# Altium project KSP_PCB.PrjPcb
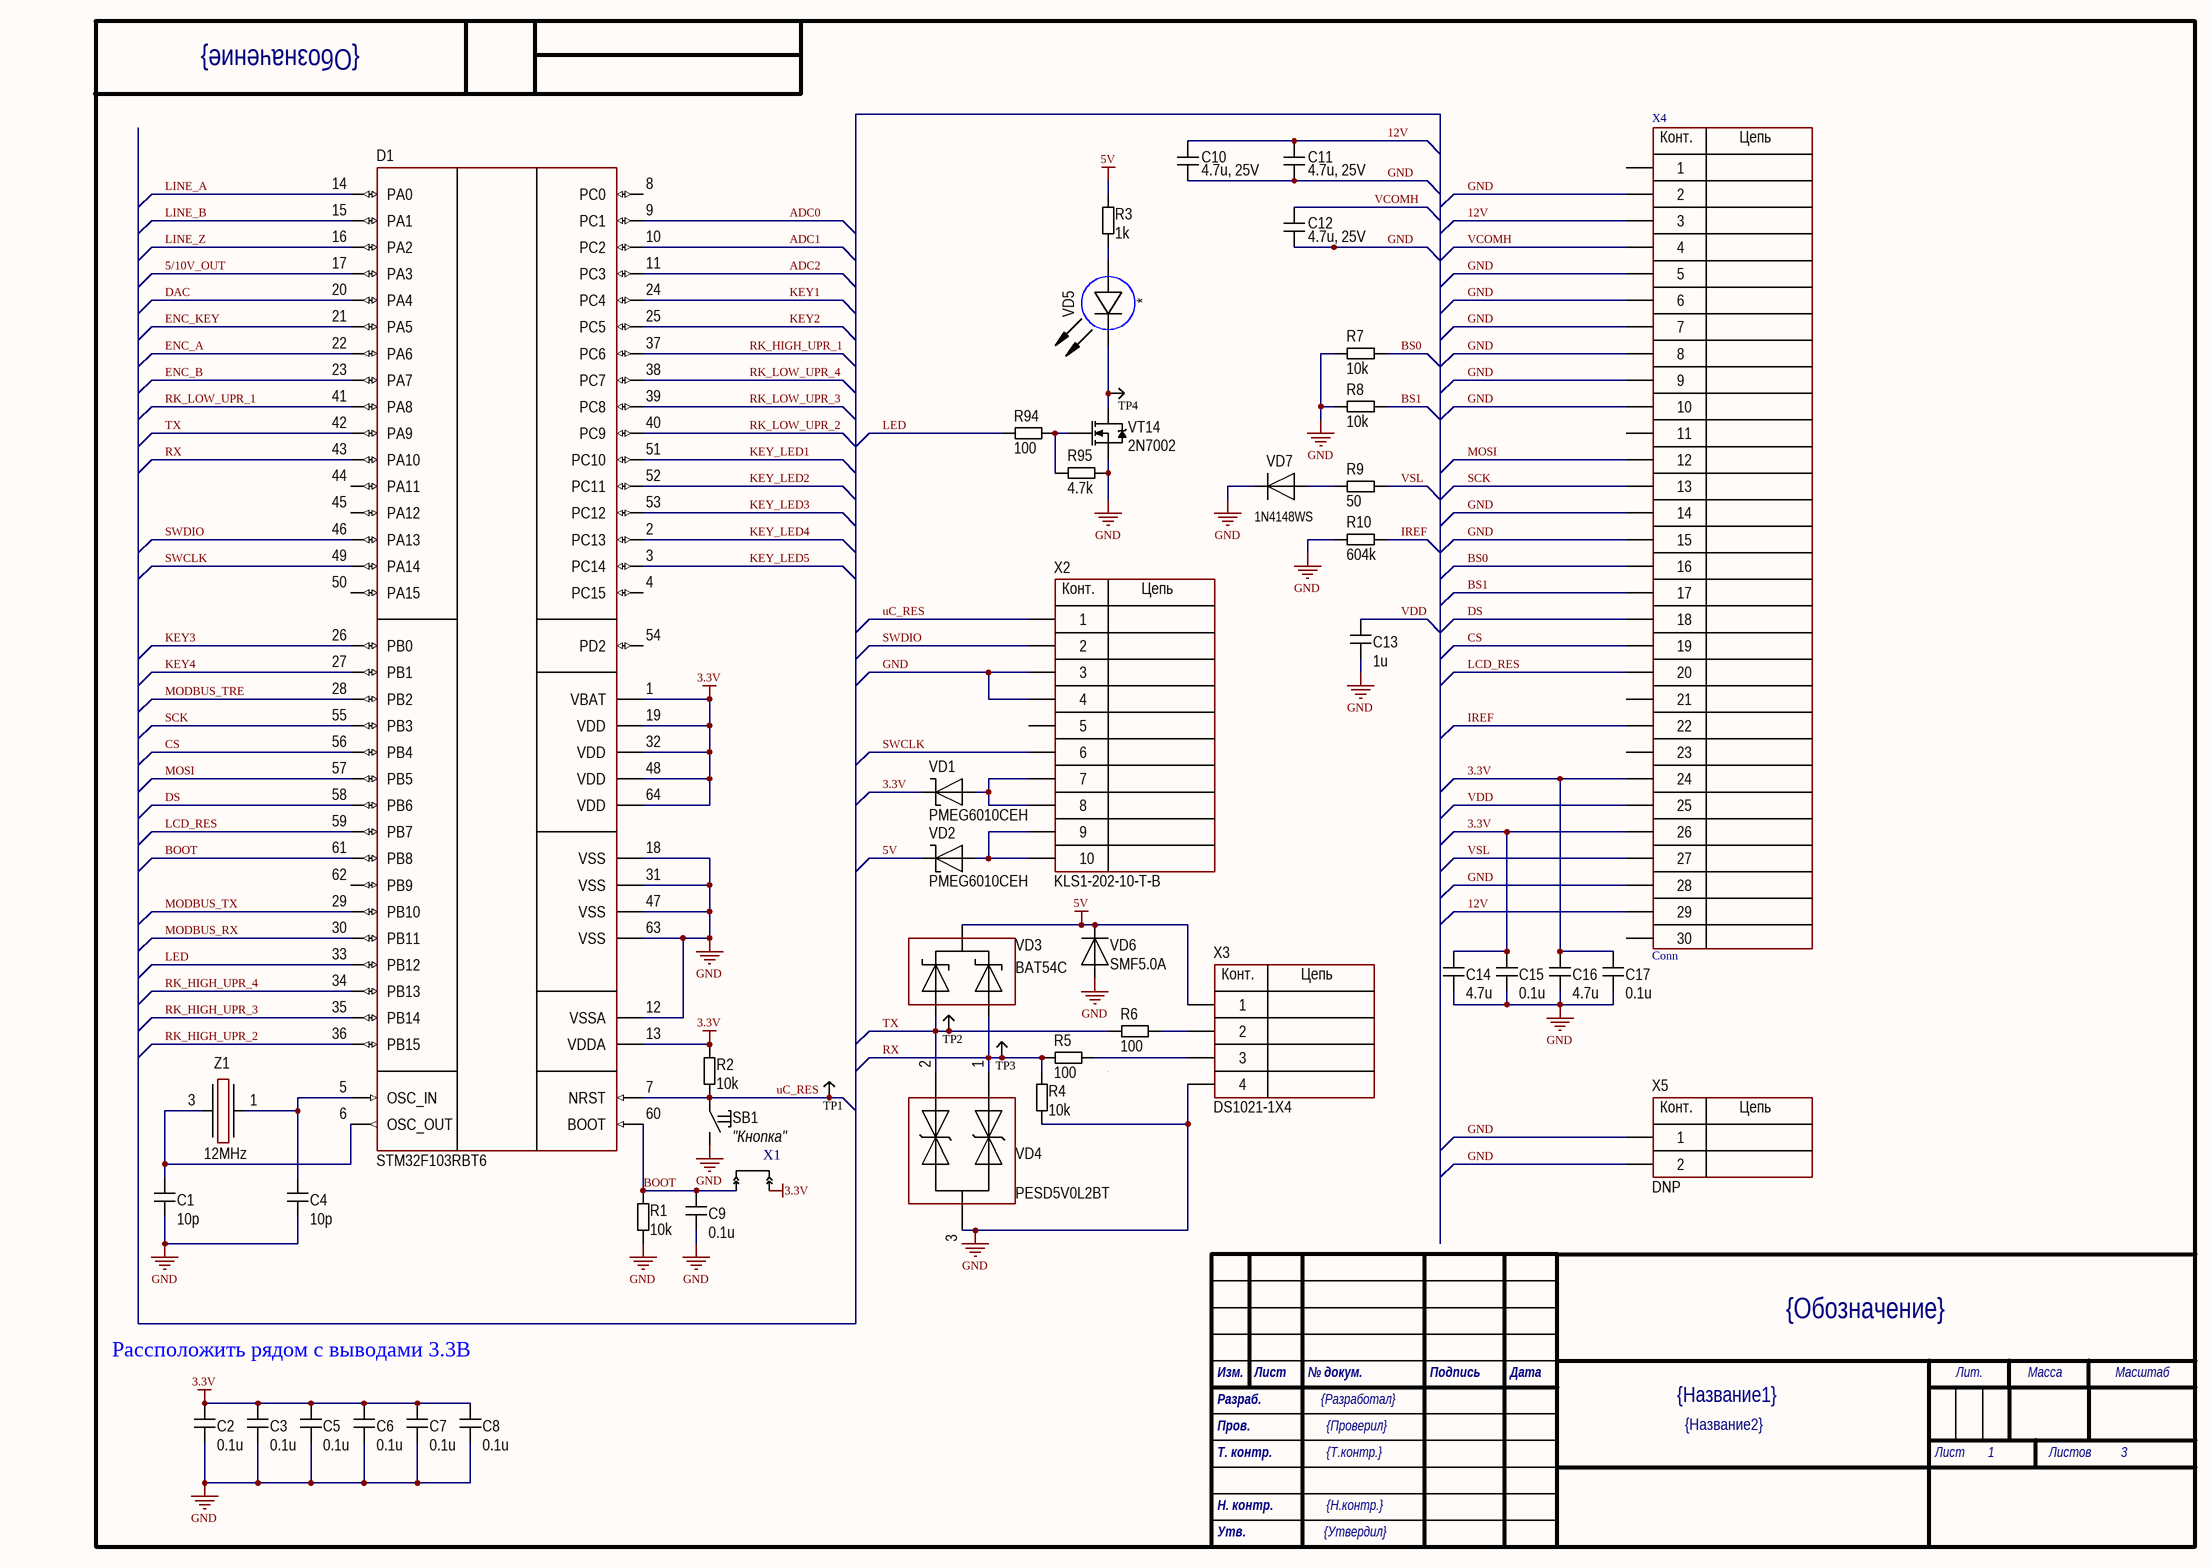
[diagram p0: 1_uC.SchDoc]
3 sheets, 210 parts. Net scope: global (net labels, ports and power ports of the same name join across sheets).
Board file: KSP_PCB.PcbDoc
Sheets:
  1_uC.SchDoc
  2_Connection.SchDoc
  3_RK.SchDoc

## Sheet 1_uC.SchDoc
size 414 x 293 mm; SheetNumber: 1; SheetTotal: 3; PageSetup: Record=PageOptionsZCenterHorizontal=TrueZCenterVertical=TrueZPrintScale=1.00ZXCorrection=0.00ZYCorrection=0.00ZPrintKind=1ZBorderSize=5000000ZLeftOffset=0ZBottomOffset=0ZOrientation=2ZPaperLength=1000ZPaperWidth=1000ZScale=100ZPaperSource=7ZPrintQuality=-4ZMediaType=1ZDitherType=10ZPaperKind=A3ZPrintScaleMode=0; Razrabotal: {Разработал}; Proveril: {Проверил}; Tkontr: {Т.контр.}; Nkontr: {Н.контр.}; Ytverdil: {Утвердил}; Nazvanie1: {Название1}; Nazvanie2: {Название2}; Oboznachenie: {Обозначение}

### Parts
C1  10p  [CH0402C]
C2  0.1u  [CH0603C]
C3  0.1u  [CH0603C]
C4  10p  [CH0402C]
C5  0.1u  [CH0603C]
C6  0.1u  [CH0603C]
C7  0.1u  [CH0603C]
C8  0.1u  [CH0603C]
C9  0.1u  [CH0603C]
C10  4.7u, 25V  [CH0805C]
C11  4.7u, 25V  [CH0805C]
C12  4.7u, 25V  [CH0805C]
C13  1u  [CH0603C]
C14  4.7u  [CH0603C]
C15  0.1u  [CH0603C]
C16  4.7u  [CH0603C]
C17  0.1u  [CH0603C]
D1  STM32F103RBT6  [64-LQFP]
R1  10k  [CH0603R]
R2  10k  [CH0603R]
R3  1k  [CH0805R]
R4  10k  [CH0603R]
R5  100  [CH0603R]
R6  100  [CH0603R]
R7  10k  [CH0603R]
R8  10k  [CH0603R]
R9  50  [CH0603R]
R10  604k  [CH0603R]
R94  100  [CH0603R]
R95  4.7k  [CH0603R]
SB1  "Кнопка"  [TL1014BF160QG]
TP1  (no value)  [TestPoint]
TP2  (no value)  [TestPoint]
TP3  (no value)  [TestPoint]
TP4  (no value)  [TestPoint]
VD1  PMEG6010CEH  [SOD123F]
VD2  PMEG6010CEH  [SOD123F]
VD3  BAT54C  [SOT23_123]
VD4  PESD5V0L2BT  [SOT23_132]
VD5  *  [CH0603LB]
VD6  SMF5.0A  [SOD123F]
VD7  1N4148WS  [SOD323]
VT14  2N7002  [SOT23_123]
X1  JMP-2  [PLS-2]  (value not drawn)
X2  KLS1-202-10-T-B  [CON: IDC-10MS]
X3  DS1021-1X4  [CON: PLS-4]
X4  Conn  [FPC-30]
X5  DNP  [CON: PLS-2]
Z1  12MHz  [OSC: 2520]

### Nets
3.3V: C2.2 C3.2 C5.2 C6.2 C7.2 C8.2 C14.2 C15.2 C16.2 C17.2 D1.1(VBAT) D1.13(VDDA) D1.19(VDD) D1.32(VDD) D1.48(VDD) D1.64(VDD) R2.2 VD1.2 X1.2 X4.24 X4.26
5V: R3.2 VD2.2 VD3.2 VD6.2 X3.1
12V: C10.2 C11.2 X4.3 X4.29
GND: C1.1 C2.1 C3.1 C4.1 C5.1 C6.1 C7.1 C8.1 C9.1 C10.1 C11.1 C12.1 C13.1 C14.1 C15.1 C16.1 C17.1 D1.12(VSSA) D1.18(VSS) D1.31(VSS) D1.47(VSS) D1.63(VSS) R1.1 R4.2 R7.1 R8.1 R10.1 R95.1 SB1.2 VD4.3 VD6.1 VD7.2 VT14.3(S) X2.3 X2.4 X3.4 X4.2 X4.5 X4.6 X4.7 X4.8 X4.9 X4.10 X4.14 X4.15 X4.28 X5.1 X5.2
5/10V_OUT: D1.17(PA3)
ADC0: D1.9(PC1)
ADC1: D1.10(PC2)
ADC2: D1.11(PC3)
BOOT: C9.2 D1.60(BOOT) D1.61(PB8) R1.2 X1.1
BS0: R7.2 X4.16
BS1: R8.2 X4.17
CS: D1.56(PB4) X4.19
DAC: D1.20(PA4)
DS: D1.58(PB6) X4.18
ENC_A: D1.22(PA6)
ENC_B: D1.23(PA7)
ENC_KEY: D1.21(PA5)
IREF: R10.2 X4.22
KEY1: D1.24(PC4)
KEY2: D1.25(PC5)
KEY3: D1.26(PB0)
KEY4: D1.27(PB1)
KEY_LED1: D1.51(PC10)
KEY_LED2: D1.52(PC11)
KEY_LED3: D1.53(PC12)
KEY_LED4: D1.2(PC13)
KEY_LED5: D1.3(PC14)
LCD_RES: D1.59(PB7) X4.20
LED: D1.33(PB12) R94.2
LINE_A: D1.14(PA0)
LINE_B: D1.15(PA1)
LINE_Z: D1.16(PA2)
MODBUS_RX: D1.30(PB11)
MODBUS_TRE: D1.28(PB2)
MODBUS_TX: D1.29(PB10)
MOSI: D1.57(PB5) X4.12
RK_HIGH_UPR_1: D1.37(PC6)
RK_HIGH_UPR_2: D1.36(PB15)
RK_HIGH_UPR_3: D1.35(PB14)
RK_HIGH_UPR_4: D1.34(PB13)
RK_LOW_UPR_1: D1.41(PA8)
RK_LOW_UPR_2: D1.40(PC9)
RK_LOW_UPR_3: D1.39(PC8)
RK_LOW_UPR_4: D1.38(PC7)
RX: D1.43(PA10) R4.1 R5.2 TP3.0 VD3.1 VD4.1
SCK: D1.55(PB3) X4.13
SWCLK: D1.49(PA14) X2.6
SWDIO: D1.46(PA13) X2.2
TX: D1.42(PA9) R6.2 TP2.0 VD3.3 VD4.2
uC_RES: D1.7(NRST) R2.1 SB1.1 TP1.0 X2.1
VCOMH: C12.2 X4.4
VDD: C13.2 X4.25
VSL: R9.2 X4.27
NetC1_2: C1.2 D1.6(OSC_OUT) Z1.3
NetC4_2: C4.2 D1.5(OSC_IN) Z1.1
NetR3_1: R3.1 VD5.1(A)
NetR5_1: R5.1 X3.3
NetR6_1: R6.1 X3.2
NetR9_1: R9.1 VD7.1
NetR94_1: R94.1 R95.2 VT14.1(G)
NetTP4_0: TP4.0 VD5.2(C) VT14.2(D)
NetVD1_1: VD1.1 X2.7 X2.8
NetVD2_1: VD2.1 X2.9 X2.10

Not connected (* = marked no-connect by the designer): D1 4(PC15) 8(PC0) 44(PA11) 45(PA12) 50(PA15) 54(PD2) 62(PB9); X2 5; X4 1 11 21 23 30

### Notes on the sheet
- Рассположить рядом с выводами 3.3В
- Изм.
- Лист
- № докум.
- Подпись
- Дата
- Лит.
- Масса
- Масштаб
- Пров.
- Разраб.
- Т. контр.
- Н. контр.
- Листов
- Утв.
- (in symbol 2-Connector) Конт.; Цепь
- (in symbol 4-Connector) Конт.; Цепь
- (in symbol 10-Connector) Конт.; Цепь
- (in symbol 30-Connector) Конт.; Цепь

### Library data of the parts
C1 C4 = Capacitor: Model: AC0402JRNPO9BN100; Manufacturer: *; HelpURL: *; ComponentKind: *; Value: 10p
C2 C3 C5-C9 C15 C17 = Capacitor: Model: 06035C104JAT2A; Manufacturer: *; HelpURL: *; ComponentKind: *; Value: 0.1u
C10-C12 = Capacitor: Model: 08053C475KAT2A; Manufacturer: *; HelpURL: *; ComponentKind: *; Value: 4.7u, 25V
C13 = Capacitor: Model: 0603B105K250NT; Manufacturer: *; HelpURL: *; ComponentKind: *; Value: 1u
C14 C16 = Capacitor: Model: 06036D475KAT2A; Manufacturer: *; HelpURL: *; ComponentKind: *; Value: 4.7u
D1 = STM32F103RBT6: Cortex-M3; Manufacturer: STMicroelectronics; Model: STM32F103RBT6; HelpURL: https://www.digikey.com/product-detail/en/stmicroelectronics/STM32F103RBT6/497-6066-ND/1646341; ComponentKind: 64-LQFP
R1 R2 R4 R7 R8 = Resistor: Model: CR0603-FX-1002ELF; Manufacturer: *; HelpURL: *; ComponentKind: *; Value: 10k
R3 = Resistor: Model: CR0805-FX-1001ELF; Manufacturer: *; HelpURL: *; ComponentKind: *; Value: *
R5 R6 R94 = Resistor: Model: CR0603-JW-101ELF; Manufacturer: *; HelpURL: *; ComponentKind: *; Value: 100
R9 = Resistor: Model: CR0603-FX-49R9ELF; Manufacturer: *; HelpURL: *; ComponentKind: *; Value: 50
R10 = Resistor: Model: CR0603-FX-6043ELF; Manufacturer: *; HelpURL: *; ComponentKind: *; Value: 604k
R95 = Resistor: Model: CR0603-FX-4701ELF; Manufacturer: *; HelpURL: *; ComponentKind: *; Value: 4.7k
SB1 = Tactile switches: 6x6 mm; Manufacturer: *; Model: TL1014BF160QG; HelpURL: *; ComponentKind: *
TP1-TP4 = TestPoint
VD1 VD2 = Diod Schottky: ComponentKind: *; Manufacturer: *; Model: PMEG6010CEH; HelpURL: *
VD3 = Diod Schottky Array v.1: ComponentKind: *; Manufacturer: *; Model: BAT54C; HelpURL: *
VD4 = TVS Array: ComponentKind: *; Manufacturer: *; Model: PESD5V0L2BT; HelpURL: *
VD5 = LED_1: Model: KPT-1608SGC; Manufacturer: *; HelpURL: *; ComponentKind: *; Value: *
VD6 = Diod: Part Num: SMAF5.0A; ComponentKind: *; Manufacturer: *; Model: SMF5.0A; HelpURL: *
VD7 = Diod: ComponentKind: *; Manufacturer: *; Model: 1N4148WS; HelpURL: *
VT14 = N-chanel: Mosfet; Model: 2N7002; Manufacturer: *; ComponentKind: *; HelpURL: *
X1 = JMP-2: Model: DNP
X2 = 10-Connector: Model: KLS1-202-10-T-B; Manufacturer: *; HelpURL: *; ComponentKind: *
X3 = 4-Connector: Model: DS1021-1X4; Manufacturer: *; HelpURL: *; ComponentKind: *
X4 = 30-Connector: Model: KLS1-242G-2.0-30-T-R
X5 = 2-Connector: Model: DNP; Manufacturer: *; HelpURL: *; ComponentKind: *
Z1 = Oscillator: Model: ECS-120-10-36B2-JTN-TR; Manufacturer: *; HelpURL: *; ComponentKind: *; Value: 12MHz

## Sheet 2_Connection.SchDoc
size 414 x 293 mm; SheetNumber: 2; SheetTotal: 3; PageSetup: Record=PageOptionsZCenterHorizontal=TrueZCenterVertical=TrueZPrintScale=1.00ZXCorrection=0.00ZYCorrection=0.00ZPrintKind=1ZBorderSize=5000000ZLeftOffset=0ZBottomOffset=0ZOrientation=2ZPaperLength=1000ZPaperWidth=1000ZScale=100ZPaperSource=7ZPrintQuality=-4ZMediaType=1ZDitherType=10ZPaperKind=A3ZPrintScaleMode=0; Razrabotal: {Разработал}; Proveril: {Проверил}; Tkontr: {Т.контр.}; Nkontr: {Н.контр.}; Ytverdil: {Утвердил}; Nazvanie1: {Название1}; Nazvanie2: {Название2}; Oboznachenie: {Обозначение}
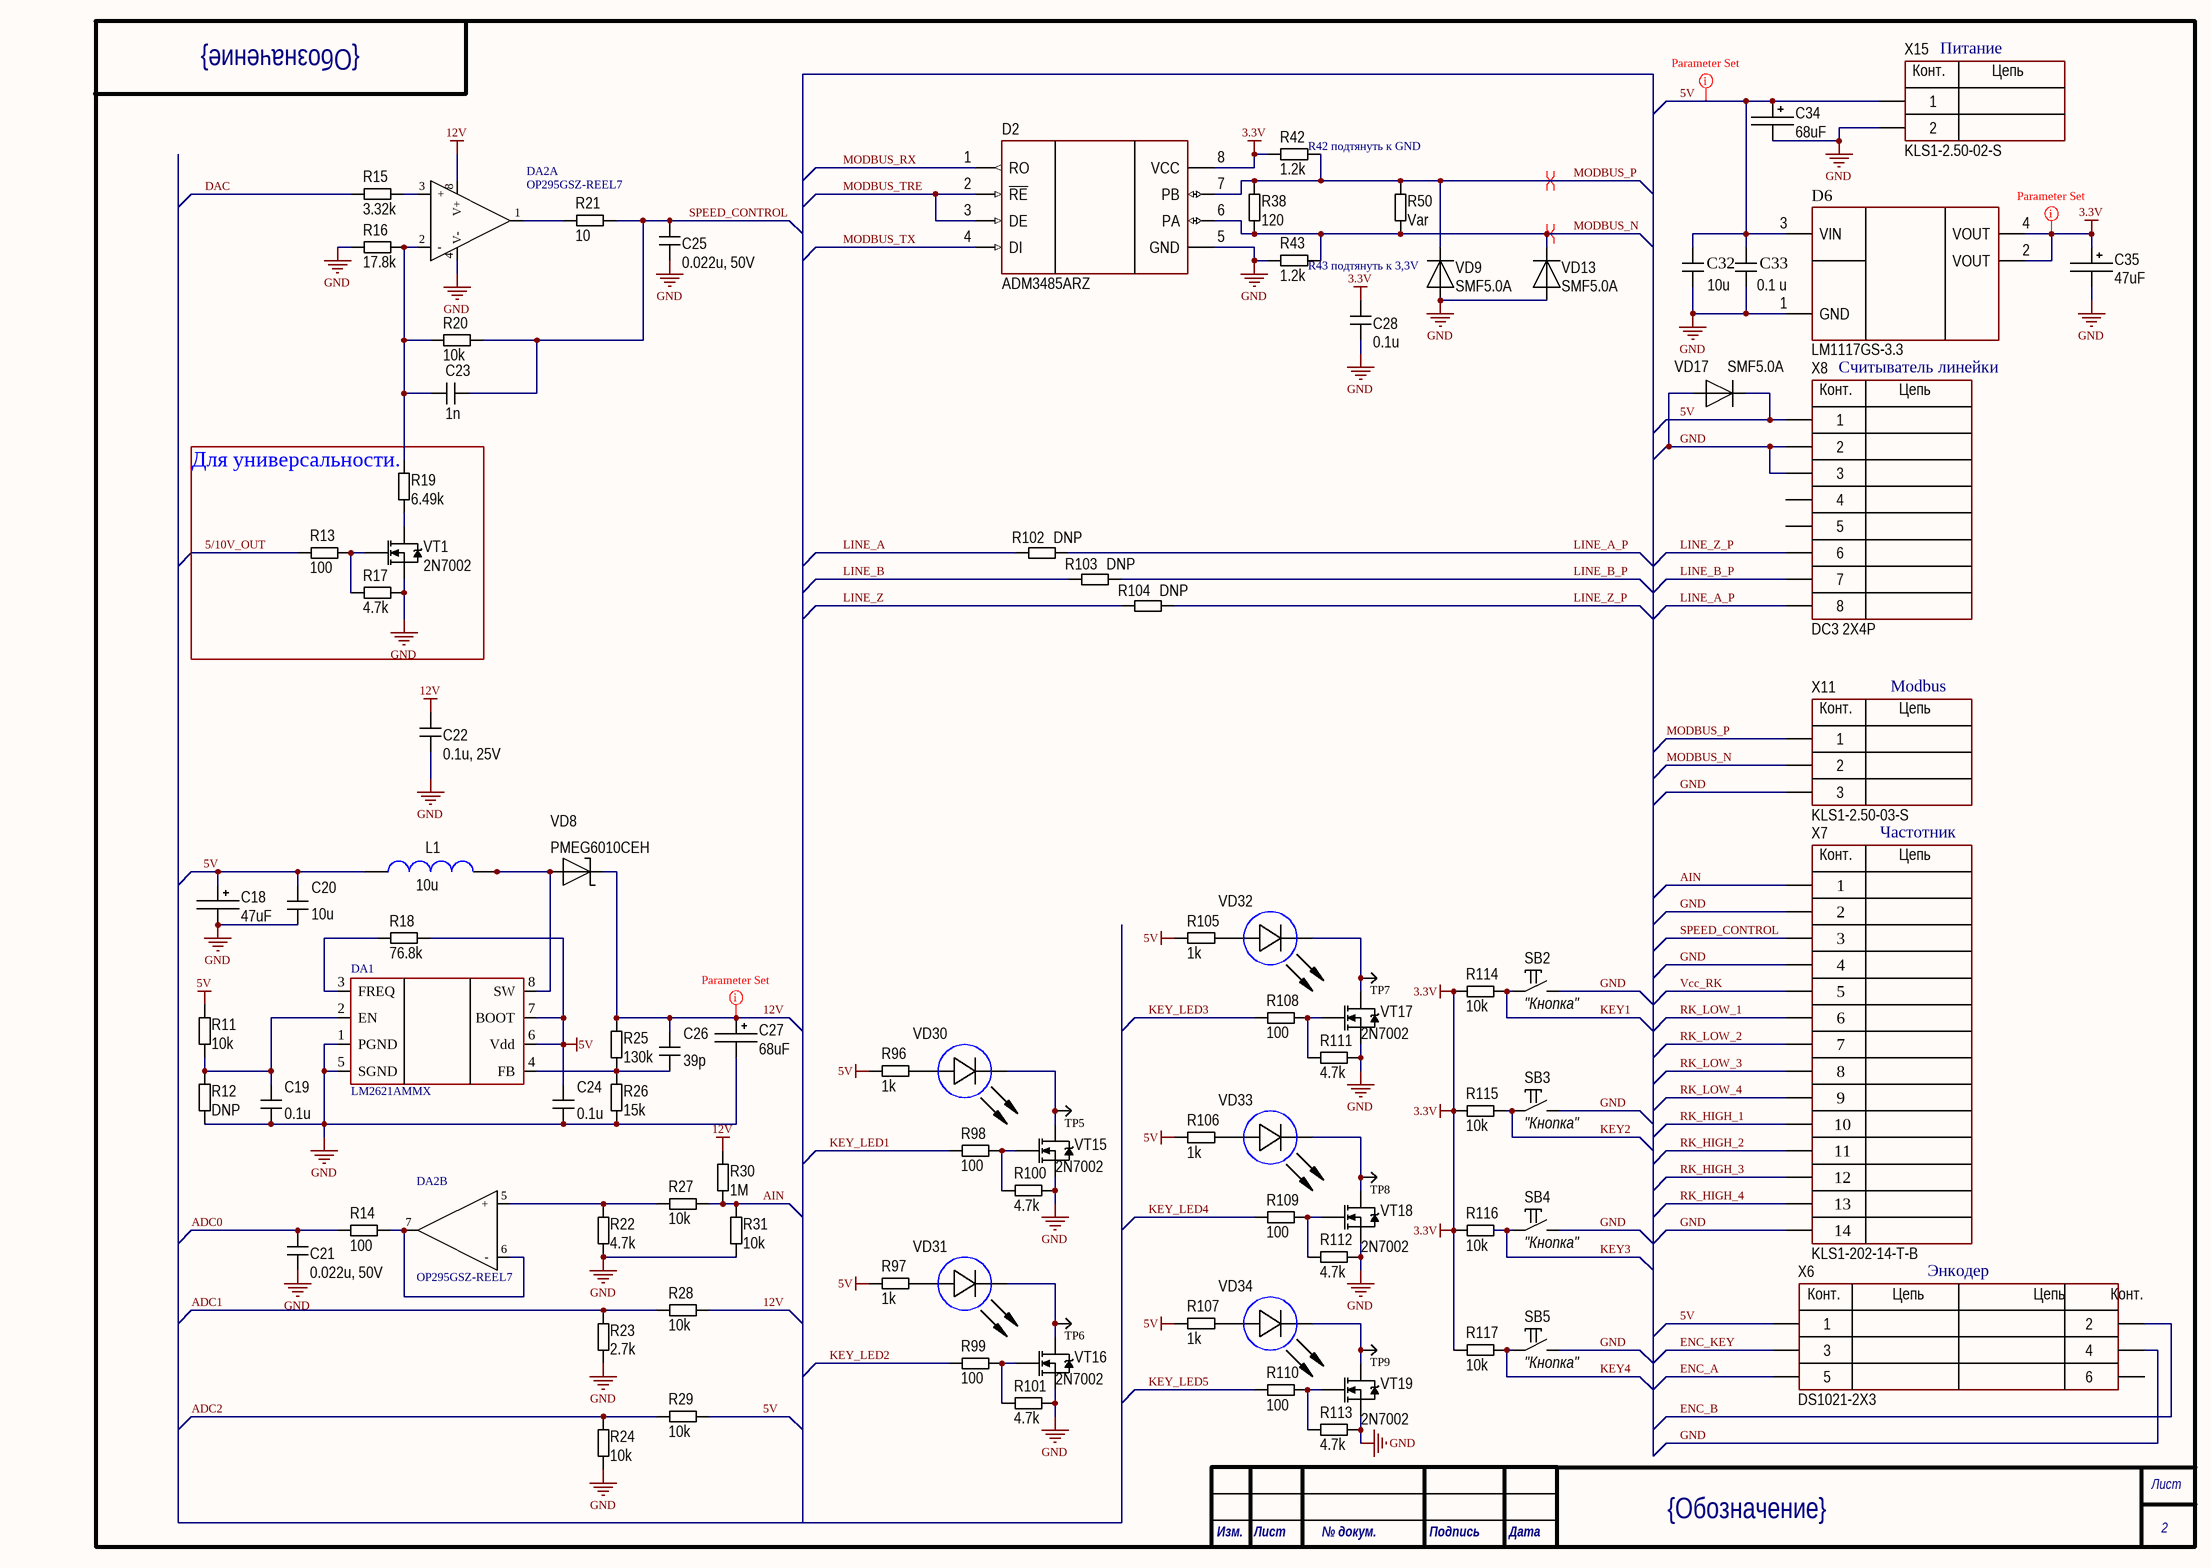
[diagram p1: 2_Connection.SchDoc]

### Parts
C18  47uF  [TANTAL_B]
C19  0.1u  [CH0603C]
C20  10u  [CH0603C]
C21  0.022u, 50V  [CH0603C]
C22  0.1u, 25V  [CH0603C]
C23  1n  [CH0603C]
C24  0.1u  [CH0603C]
C25  0.022u, 50V  [CH0603C]
C26  39p  [CH0603C]
C27  68uF  [TANTAL_D]
C28  0.1u  [CH0603C]
C32  10u  [CH0805C]
C33  0.1 u  [CH0603C]
C34  68uF  [TANTAL_B]
C35  47uF  [TANTAL_A]
D2  ADM3485ARZ  [8-SOIC]
D6  LM1117GS-3.3  [SOT223]
DA1  LM2621AMMX  [8-SSOP]
DA2  OP295GSZ-REEL7  [8-SOIC]  (parts A,B of 2)
L1  10u  [IND: IHLP2020]
R11  10k  [CH0603R]
R12  DNP  [CH0603R]
R13  100  [CH0603R]
R14  100  [CH0603R]
R15  3.32k  [CH0603R]
R16  17.8k  [CH0603R]
R17  4.7k  [CH0603R]
R18  76.8k  [CH0603R]
R19  6.49k  [CH0603R]
R20  10k  [CH0603R]
R21  10  [CH0603R]
R22  4.7k  [CH0603R]
R23  2.7k  [CH0603R]
R24  10k  [CH0603R]
R25  130k  [CH0603R]
R26  15k  [CH0603R]
R27  10k  [CH0603R]
R28  10k  [CH0603R]
R29  10k  [CH0603R]
R30  1M  [CH0603R]
R31  10k  [CH0603R]
R38  120  [CH1206R]
R42  1.2k  [CH0603R]
R43  1.2k  [CH0603R]
R50  Var  [CH1206R]
R96  1k  [CH0805R]
R97  1k  [CH0805R]
R98  100  [CH0603R]
R99  100  [CH0603R]
R100  4.7k  [CH0603R]
R101  4.7k  [CH0603R]
R102  DNP  [CH0603R]
R103  DNP  [CH0603R]
R104  DNP  [CH0603R]
R105  1k  [CH0805R]
R106  1k  [CH0805R]
R107  1k  [CH0805R]
R108  100  [CH0603R]
R109  100  [CH0603R]
R110  100  [CH0603R]
R111  4.7k  [CH0603R]
R112  4.7k  [CH0603R]
R113  4.7k  [CH0603R]
R114  10k  [CH0603R]
R115  10k  [CH0603R]
R116  10k  [CH0603R]
R117  10k  [CH0603R]
SB2  "Кнопка"  [BUT: SKQGADE010]
SB3  "Кнопка"  [BUT: SKQGADE010]
SB4  "Кнопка"  [BUT: SKQGADE010]
SB5  "Кнопка"  [BUT: SKQGADE010]
TP5  (no value)  [TestPoint]
TP6  (no value)  [TestPoint]
TP7  (no value)  [TestPoint]
TP8  (no value)  [TestPoint]
TP9  (no value)  [TestPoint]
VD8  PMEG6010CEH  [SOD123F]
VD9  SMF5.0A  [SOD123F]
VD13  SMF5.0A  [SOD123F]
VD17  SMF5.0A  [SOD123F]
VD30  BLUE  [CH0603LB]  (value not drawn)
VD31  BLUE  [CH0603LB]  (value not drawn)
VD32  BLUE  [CH0603LB]  (value not drawn)
VD33  BLUE  [CH0603LB]  (value not drawn)
VD34  BLUE  [CH0603LB]  (value not drawn)
VT1  2N7002  [SOT23_123]
VT15  2N7002  [SOT23_123]
VT16  2N7002  [SOT23_123]
VT17  2N7002  [SOT23_123]
VT18  2N7002  [SOT23_123]
VT19  2N7002  [SOT23_123]
X6  DS1021-2X3  [CON: PLD-6 (without body)]
X7  KLS1-202-14-T-B  [CON: IDC-14MS]
X8  DC3 2X4P  [CON: DC3 2x4P]
X11  KLS1-2.50-03-S  [CON: CWF-3]
X15  KLS1-2.50-02-S  [CON: CWF-2]

### Blocks framed on the sheet
Для универсальности.: R13 R17 R19 VT1

### Nets
3.3V: C28.2 C35.1 D2.8(VCC) D6.2(VOUT) D6.4(VOUT) R42.2 R114.2 R115.2 R116.2 R117.2
5V: C18.1 C20.2 C24.2 C32.2 C33.2 C34.1 D6.3(VIN) DA1.6(Vdd) DA1.7(BOOT) L1.2 R11.1 R18.1 R29.1 R96.2 R97.2 R105.2 R106.2 R107.2 VD17.2 X6.1 X8.1 X15.1
12V: C22.2 C26.2 C27.1 DA2.8(V+) R25.1 R28.1 R30.1 VD8.2
GND: C18.2 C19.1 C20.1 C21.1 C22.1 C24.1 C25.1 C27.2 C28.1 C32.1 C33.1 C34.2 C35.2 D2.5(GND) D6.1(GND) DA1.1(PGND) DA1.5(SGND) DA2.4(V-) R12.2 R16.2 R17.1 R22.2 R23.2 R24.2 R26.2 R31.2 R43.2 R100.1 R101.1 R111.1 R112.1 R113.1 SB2.2 SB3.2 SB4.2 SB5.2 VD9.1 VD13.1 VD17.1 VT1.3(S) VT15.3(S) VT16.3(S) VT17.3(S) VT18.3(S) VT19.3(S) X6.4 X7.2 X7.4 X7.14 X8.2 X8.3 X11.3 X15.2
5/10V_OUT: R13.2
ADC0: C21.2 R14.1
ADC1: R23.1 R28.2
ADC2: R24.1 R29.2
AIN: R27.1 R30.2 R31.1 X7.1
DAC: R15.2
ENC_A: X6.5
ENC_B: X6.2
ENC_KEY: X6.3
KEY1: R114.1 SB2.1
KEY2: R115.1 SB3.1
KEY3: R116.1 SB4.1
KEY4: R117.1 SB5.1
KEY_LED1: R98.2
KEY_LED2: R99.2
KEY_LED3: R108.2
KEY_LED4: R109.2
KEY_LED5: R110.2
LINE_A: R102.2
LINE_A_P: R102.1 X8.8
LINE_B: R103.2
LINE_B_P: R103.1 X8.7
LINE_Z: R104.2
LINE_Z_P: R104.1 X8.6
MODBUS_N: D2.6(PA) R38.1 R43.1 R50.1 VD13.2 X11.2
MODBUS_P: D2.7(PB) R38.2 R42.1 R50.2 VD9.2 X11.1
MODBUS_RX: D2.1(RO)
MODBUS_TRE: D2.2(~{RE}) D2.3(DE)
MODBUS_TX: D2.4(DI)
RK_HIGH_1: X7.10
RK_HIGH_2: X7.11
RK_HIGH_3: X7.12
RK_HIGH_4: X7.13
RK_LOW_1: X7.6
RK_LOW_2: X7.7
RK_LOW_3: X7.8
RK_LOW_4: X7.9
SPEED_CONTROL: C23.1 C25.2 R20.1 R21.1 X7.3
Vcc_RK: X7.5
NetC19_2: C19.2 DA1.2(EN) R11.2 R12.1
NetC23_2: C23.2 DA2.2(-) R16.1 R19.1 R20.2
NetC26_1: C26.1 DA1.4(FB) R25.2 R26.1
NetDA1_3: DA1.3(FREQ) R18.2
NetDA1_8: DA1.8(SW) L1.1 VD8.1
NetDA2_1: DA2.1(OUT) R21.2
NetDA2_3: DA2.3(+) R15.1
NetDA2_5: DA2.5(+) R22.1 R27.2
NetDA2_6: DA2.6(-) DA2.7(OUT) R14.2
NetR13_1: R13.1 R17.2 VT1.1(G)
NetR19_2: R19.2 VT1.2(D)
NetR96_1: R96.1 VD30.1(A)
NetR97_1: R97.1 VD31.1(A)
NetR98_1: R98.1 R100.2 VT15.1(G)
NetR99_1: R99.1 R101.2 VT16.1(G)
NetR105_1: R105.1 VD32.1(A)
NetR106_1: R106.1 VD33.1(A)
NetR107_1: R107.1 VD34.1(A)
NetR108_1: R108.1 R111.2 VT17.1(G)
NetR109_1: R109.1 R112.2 VT18.1(G)
NetR110_1: R110.1 R113.2 VT19.1(G)
NetTP5_0: TP5.0 VD30.2(C) VT15.2(D)
NetTP6_0: TP6.0 VD31.2(C) VT16.2(D)
NetTP7_0: TP7.0 VD32.2(C) VT17.2(D)
NetTP8_0: TP8.0 VD33.2(C) VT18.2(D)
NetTP9_0: TP9.0 VD34.2(C) VT19.2(D)

Not connected (* = marked no-connect by the designer): X6 6; X8 4 5

### Layout directives
differential pair: MODBUS_N, MODBUS_P
rule Supply Nets [Voltage = 5.000]: 5V
rule Supply Nets [Voltage = 12.00]: 12V
rule Supply Nets [Voltage = 3.300]: 3.3V

### Notes on the sheet
- Питание
- (near R42) R42 подтянуть к GND
- (near R43) R43 подтянуть к 3,3V
- Считыватель линейки
- Modbus
- Частотник
- (near X6) Энкодер
- Лист
- Изм.
- № докум.
- Подпись
- Дата
- (in symbol 2-Connector) Конт.; Цепь
- (in symbol 3-Connector) Конт.; Цепь
- (in symbol 6(2)-Connector) Конт.; Цепь
- (in symbol 8-Connector) Конт.; Цепь
- (in symbol 14-Connector) Конт.; Цепь

### Library data of the parts
C18 = TantalCap: Model: 293D476X9010B2TE3; Manufacturer: *; HelpURL: *; ComponentKind: *; Value: 47uF
C19 C22 C24 C28 C33 = Capacitor: Model: 06035C104JAT2A; Manufacturer: *; HelpURL: *; ComponentKind: *
  C19 C24 C28: Value: 0.1u
  C22: Value: 0.1u, 25V
  C33: Value: 0.1 u
C20 C32 = Capacitor: Model: GRM21BR71A106KE51; Manufacturer: *; HelpURL: *; ComponentKind: *; Value: 10u
C21 C25 = Capacitor: Model: 06035C223JAT2A; Manufacturer: *; HelpURL: *; ComponentKind: *; Value: 0.022u, 50V
C23 = Capacitor: Model: 06035A102JAT2A; Manufacturer: *; HelpURL: *; ComponentKind: *; Value: 1n
C26 = Capacitor: Model: CC0603JRNPO9BN390; Manufacturer: *; HelpURL: *; ComponentKind: *; Value: 39p
C27 = TantalCap: Model: 293D686X9020D2TE3; Manufacturer: *; HelpURL: *; ComponentKind: *; Value: 68uF
C34 = TantalCap: Model: 293D686X9010B2TE3; Manufacturer: *; HelpURL: *; ComponentKind: *; Value: 68uF
C35 = TantalCap: Model: 293D476X96R3A2TE3; Manufacturer: *; HelpURL: *; ComponentKind: *; Value: 47uF
D2 = ADM3485ARZ: RS485; Manufacturer: Analog Devices Inc.; Model: ADM3485ARZ-REEL7; HelpURL: https://www.digikey.com/product-detail/en/analog-devices-inc/ADM3485ARZ-REEL7/ADM3485ARZ-REEL7CT-ND/3878705; ComponentKind: 8-SOIC
D6 = LDL1117S33R: LDO; Manufacturer: STMicroelectronics; Model: LM1117GS-3.3; HelpURL: https://www.digikey.com/product-detail/en/stmicroelectronics/LDL1117S33R/497-17239-1-ND/7102079; ComponentKind: SOT-223; Value: LM1117GS-3.3
DA1 = LM2623AMMX: Model: LM2621AMMX
DA2 = OP295: Value: OP295GSZ-REEL7; Model: OP295GSZ-REEL7
L1 = Inductor: Model: IHLP2020CZER100M11; Manufacturer: *; HelpURL: *; ComponentKind: *; Value: 10u
R11 R20 R24 R27-R29 R31 R114-R117 = Resistor: Model: CR0603-FX-1002ELF; Manufacturer: *; HelpURL: *; ComponentKind: *; Value: 10k
R12 R102-R104 = Resistor: Manufacturer: *; Model: *; HelpURL: *; ComponentKind: *; Value: DNP
R13 R14 R98 R99 R108-R110 = Resistor: Model: CR0603-JW-101ELF; Manufacturer: *; HelpURL: *; ComponentKind: *; Value: 100
R15 = Resistor: Model: CR0603-FX-3321ELF; Manufacturer: *; HelpURL: *; ComponentKind: *; Value: 3.32k
R16 = Resistor: Model: CR0603-FX-1782ELF; Manufacturer: *; HelpURL: *; ComponentKind: *; Value: 17.8k
R17 R22 R100 R101 R111-R113 = Resistor: Model: CR0603-FX-4701ELF; Manufacturer: *; HelpURL: *; ComponentKind: *; Value: 4.7k
R18 = Resistor: Model: CR0603-FX-7682ELF; Manufacturer: *; HelpURL: *; ComponentKind: *; Value: 76.8k
R19 = Resistor: Model: CR0603-FX-6491ELF; Manufacturer: *; HelpURL: *; ComponentKind: *; Value: 6.49k
R21 = Resistor: Model: CR0603-FX-10R0ELF; Manufacturer: *; HelpURL: *; ComponentKind: *; Value: 10
R23 = Resistor: Model: CR0603-FX-2701ELF; Manufacturer: *; HelpURL: *; ComponentKind: *; Value: 2.7k
R25 = Resistor: Model: CR0603-FX-1303ELF; Manufacturer: *; HelpURL: *; ComponentKind: *; Value: 130k
R26 = Resistor: Model: CR0603-FX-1502ELF; Manufacturer: *; HelpURL: *; ComponentKind: *; Value: 15k
R30 = Resistor: Model: CR0603-FX-1004ELF; Manufacturer: *; HelpURL: *; ComponentKind: *; Value: 1M
R38 = Resistor: Model: CR1206-FX-1200ELF; Manufacturer: *; HelpURL: *; ComponentKind: *; Value: 120
R42 R43 = Resistor: Model: CR0603-FX-1201ELF; Manufacturer: *; HelpURL: *; ComponentKind: *; Value: 1.2k
R50 = Resistor: Model: JMV0805S5R6T661; Manufacturer: *; HelpURL: *; ComponentKind: *; Value: Var; Part: JMV0805S5R6T661
R96 R97 R105-R107 = Resistor: Model: CR0805-FX-1001ELF; Manufacturer: *; HelpURL: *; ComponentKind: *; Value: *
SB2-SB5 = Tactile switches: 6x6 mm; Model: SKQGADE010; Manufacturer: *; HelpURL: *; ComponentKind: *
TP5-TP9 = TestPoint
VD8 = Diod Schottky: ComponentKind: *; Manufacturer: *; Model: PMEG6010CEH; HelpURL: *
VD9 VD13 VD17 = Diod: Part Num: SMAF5.0A; ComponentKind: *; Manufacturer: *; Model: SMF5.0A; HelpURL: *
VD30-VD34 = LED_1: Model: KPT-1608SGC; Manufacturer: *; HelpURL: *; ComponentKind: *; Value: *
VT1 VT15-VT19 = N-chanel: Mosfet; Model: 2N7002; Manufacturer: *; ComponentKind: *; HelpURL: *
X6 = 6(2)-Connector: Model: DS1021-2X3; Manufacturer: *; HelpURL: *; ComponentKind: *
X7 = 14-Connector: Model: KLS1-202-14-T-B; Manufacturer: *; HelpURL: *; ComponentKind: *
X8 = 8-Connector: Model: DC3 2X4P; Manufacturer: *; HelpURL: *; ComponentKind: *
X11 = 3-Connector: Model: KLS1-2.50-03-S; Manufacturer: *; HelpURL: *; ComponentKind: *
X15 = 2-Connector: Model: KLS1-2.50-02-S; Manufacturer: *; HelpURL: *; ComponentKind: *

## Sheet 3_RK.SchDoc
size 414 x 293 mm; SheetNumber: 3; SheetTotal: 3
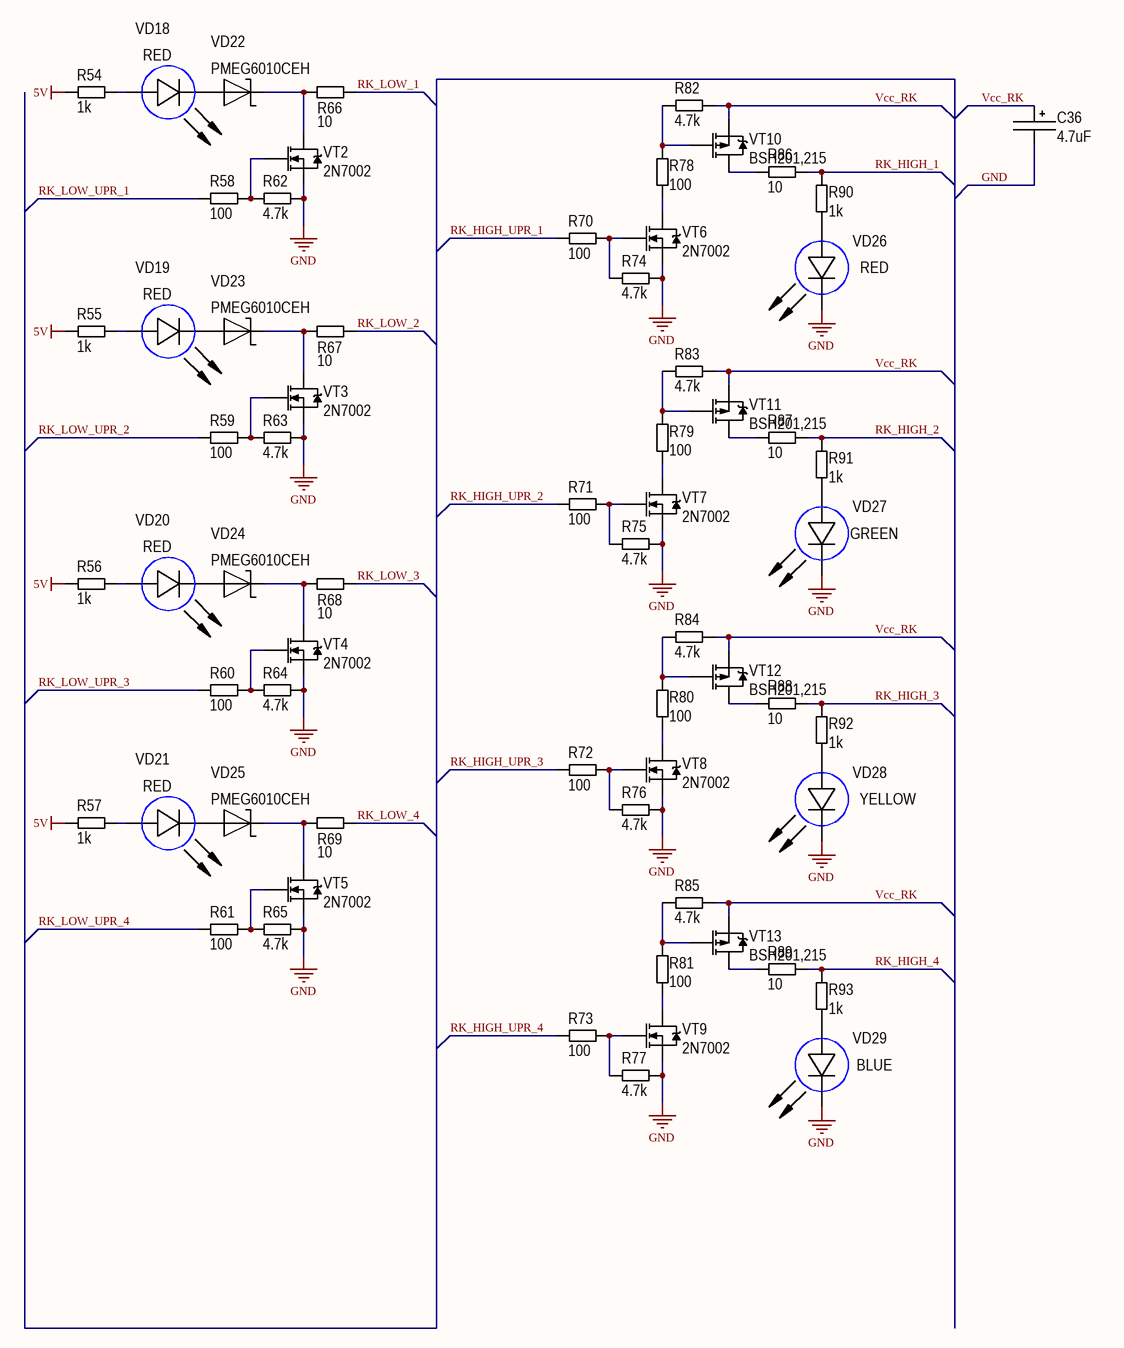
[diagram p2: 3_RK.SchDoc]

### Parts
C36  4.7uF  [TANTAL_C]
R54  1k  [CH0805R]
R55  1k  [CH0805R]
R56  1k  [CH0805R]
R57  1k  [CH0805R]
R58  100  [CH0603R]
R59  100  [CH0603R]
R60  100  [CH0603R]
R61  100  [CH0603R]
R62  4.7k  [CH0603R]
R63  4.7k  [CH0603R]
R64  4.7k  [CH0603R]
R65  4.7k  [CH0603R]
R66  10  [CH0603R]
R67  10  [CH0603R]
R68  10  [CH0603R]
R69  10  [CH0603R]
R70  100  [CH0603R]
R71  100  [CH0603R]
R72  100  [CH0603R]
R73  100  [CH0603R]
R74  4.7k  [CH0603R]
R75  4.7k  [CH0603R]
R76  4.7k  [CH0603R]
R77  4.7k  [CH0603R]
R78  100  [CH0603R]
R79  100  [CH0603R]
R80  100  [CH0603R]
R81  100  [CH0603R]
R82  4.7k  [CH0603R]
R83  4.7k  [CH0603R]
R84  4.7k  [CH0603R]
R85  4.7k  [CH0603R]
R86  10  [CH0603R]
R87  10  [CH0603R]
R88  10  [CH0603R]
R89  10  [CH0603R]
R90  1k  [CH0805R]
R91  1k  [CH0805R]
R92  1k  [CH0805R]
R93  1k  [CH0805R]
VD18  RED  [CH0603LB]
VD19  RED  [CH0603LB]
VD20  RED  [CH0603LB]
VD21  RED  [CH0603LB]
VD22  PMEG6010CEH  [SOD123F]
VD23  PMEG6010CEH  [SOD123F]
VD24  PMEG6010CEH  [SOD123F]
VD25  PMEG6010CEH  [SOD123F]
VD26  RED  [CH0603LB]
VD27  GREEN  [CH0603LB]
VD28  YELLOW  [CH0603LB]
VD29  BLUE  [CH0603LB]
VT2  2N7002  [SOT23_123]
VT3  2N7002  [SOT23_123]
VT4  2N7002  [SOT23_123]
VT5  2N7002  [SOT23_123]
VT6  2N7002  [SOT23_123]
VT7  2N7002  [SOT23_123]
VT8  2N7002  [SOT23_123]
VT9  2N7002  [SOT23_123]
VT10  BSH201,215  [SOT23_123]
VT11  BSH201,215  [SOT23_123]
VT12  BSH201,215  [SOT23_123]
VT13  BSH201,215  [SOT23_123]

### Nets
5V: R54.2 R55.2 R56.2 R57.2
GND: C36.2 R62.1 R63.1 R64.1 R65.1 R74.1 R75.1 R76.1 R77.1 VD26.2(C) VD27.2(C) VD28.2(C) VD29.2(C) VT2.3(S) VT3.3(S) VT4.3(S) VT5.3(S) VT6.3(S) VT7.3(S) VT8.3(S) VT9.3(S)
RK_HIGH_1: R86.1 R90.2
RK_HIGH_2: R87.1 R91.2
RK_HIGH_3: R88.1 R92.2
RK_HIGH_4: R89.1 R93.2
RK_HIGH_UPR_1: R70.2
RK_HIGH_UPR_2: R71.2
RK_HIGH_UPR_3: R72.2
RK_HIGH_UPR_4: R73.2
RK_LOW_1: R66.1
RK_LOW_2: R67.1
RK_LOW_3: R68.1
RK_LOW_4: R69.1
RK_LOW_UPR_1: R58.2
RK_LOW_UPR_2: R59.2
RK_LOW_UPR_3: R60.2
RK_LOW_UPR_4: R61.2
Vcc_RK: C36.1 R82.1 R83.1 R84.1 R85.1 VT10.3(S) VT11.3(S) VT12.3(S) VT13.3(S)
NetR54_1: R54.1 VD18.1(A)
NetR55_1: R55.1 VD19.1(A)
NetR56_1: R56.1 VD20.1(A)
NetR57_1: R57.1 VD21.1(A)
NetR58_1: R58.1 R62.2 VT2.1(G)
NetR59_1: R59.1 R63.2 VT3.1(G)
NetR60_1: R60.1 R64.2 VT4.1(G)
NetR61_1: R61.1 R65.2 VT5.1(G)
NetR66_2: R66.2 VD22.2 VT2.2(D)
NetR67_2: R67.2 VD23.2 VT3.2(D)
NetR68_2: R68.2 VD24.2 VT4.2(D)
NetR69_2: R69.2 VD25.2 VT5.2(D)
NetR70_1: R70.1 R74.2 VT6.1(G)
NetR71_1: R71.1 R75.2 VT7.1(G)
NetR72_1: R72.1 R76.2 VT8.1(G)
NetR73_1: R73.1 R77.2 VT9.1(G)
NetR78_1: R78.1 R82.2 VT10.1(G)
NetR78_2: R78.2 VT6.2(D)
NetR79_1: R79.1 R83.2 VT11.1(G)
NetR79_2: R79.2 VT7.2(D)
NetR80_1: R80.1 R84.2 VT12.1(G)
NetR80_2: R80.2 VT8.2(D)
NetR81_1: R81.1 R85.2 VT13.1(G)
NetR81_2: R81.2 VT9.2(D)
NetR86_2: R86.2 VT10.2(D)
NetR87_2: R87.2 VT11.2(D)
NetR88_2: R88.2 VT12.2(D)
NetR89_2: R89.2 VT13.2(D)
NetR90_1: R90.1 VD26.1(A)
NetR91_1: R91.1 VD27.1(A)
NetR92_1: R92.1 VD28.1(A)
NetR93_1: R93.1 VD29.1(A)
NetVD18_2: VD18.2(C) VD22.1
NetVD19_2: VD19.2(C) VD23.1
NetVD20_2: VD20.2(C) VD24.1
NetVD21_2: VD21.2(C) VD25.1

### Notes on the sheet
- Лист
- Изм.
- № докум.
- Подпись
- Дата

### Library data of the parts
C36 = TantalCap: Model: 293D475X9035C2TE3; Manufacturer: *; HelpURL: *; ComponentKind: *; Value: 4.7uF
R54-R57 R90-R93 = Resistor: Model: CR0805-FX-1001ELF; Manufacturer: *; HelpURL: *; ComponentKind: *; Value: *
R58-R61 R70-R73 R78-R81 = Resistor: Model: CR0603-JW-101ELF; Manufacturer: *; HelpURL: *; ComponentKind: *; Value: 100
R62-R65 R74-R77 R82-R85 = Resistor: Model: CR0603-FX-4701ELF; Manufacturer: *; HelpURL: *; ComponentKind: *; Value: 4.7k
R66-R69 R86-R89 = Resistor: Manufacturer: *; Model: *; HelpURL: *; ComponentKind: *; Value: 10
VD18-VD21 VD26-VD29 = LED_1: Model: KPT-1608SGC; Manufacturer: *; HelpURL: *; ComponentKind: *; Value: *
VD22-VD25 = Diod Schottky: ComponentKind: *; Manufacturer: *; Model: PMEG6010CEH; HelpURL: *
VT2-VT9 = N-chanel: Mosfet; Model: 2N7002; Manufacturer: *; ComponentKind: *; HelpURL: *
VT10-VT13 = P-chanel: Mosfet; Model: BSH201,215; Manufacturer: *; ComponentKind: *; HelpURL: *

## Nets that join several sheets
3.3V: 1_uC (21 pins), 2_Connection (10 pins)
5V: 1_uC (5 pins), 2_Connection (22 pins), 3_RK (R54.2 R55.2 R56.2 R57.2)
12V: 1_uC (C10.2 C11.2 X4.3 X4.29), 2_Connection (8 pins)
GND: 1_uC (48 pins), 2_Connection (53 pins), 3_RK (21 pins)
5/10V_OUT: 1_uC (D1.17), 2_Connection (R13.2)
ADC0: 1_uC (D1.9), 2_Connection (C21.2 R14.1)
ADC1: 1_uC (D1.10), 2_Connection (R23.1 R28.2)
ADC2: 1_uC (D1.11), 2_Connection (R24.1 R29.2)
DAC: 1_uC (D1.20), 2_Connection (R15.2)
ENC_A: 1_uC (D1.22), 2_Connection (X6.5)
ENC_B: 1_uC (D1.23), 2_Connection (X6.2)
ENC_KEY: 1_uC (D1.21), 2_Connection (X6.3)
KEY1: 1_uC (D1.24), 2_Connection (R114.1 SB2.1)
KEY2: 1_uC (D1.25), 2_Connection (R115.1 SB3.1)
KEY3: 1_uC (D1.26), 2_Connection (R116.1 SB4.1)
KEY4: 1_uC (D1.27), 2_Connection (R117.1 SB5.1)
KEY_LED1: 1_uC (D1.51), 2_Connection (R98.2)
KEY_LED2: 1_uC (D1.52), 2_Connection (R99.2)
KEY_LED3: 1_uC (D1.53), 2_Connection (R108.2)
KEY_LED4: 1_uC (D1.2), 2_Connection (R109.2)
KEY_LED5: 1_uC (D1.3), 2_Connection (R110.2)
LINE_A: 1_uC (D1.14), 2_Connection (R102.2)
LINE_B: 1_uC (D1.15), 2_Connection (R103.2)
LINE_Z: 1_uC (D1.16), 2_Connection (R104.2)
MODBUS_RX: 1_uC (D1.30), 2_Connection (D2.1)
MODBUS_TRE: 1_uC (D1.28), 2_Connection (D2.2 D2.3)
MODBUS_TX: 1_uC (D1.29), 2_Connection (D2.4)
RK_HIGH_1: 2_Connection (X7.10), 3_RK (R86.1 R90.2)
RK_HIGH_2: 2_Connection (X7.11), 3_RK (R87.1 R91.2)
RK_HIGH_3: 2_Connection (X7.12), 3_RK (R88.1 R92.2)
RK_HIGH_4: 2_Connection (X7.13), 3_RK (R89.1 R93.2)
RK_HIGH_UPR_1: 1_uC (D1.37), 3_RK (R70.2)
RK_HIGH_UPR_2: 1_uC (D1.36), 3_RK (R71.2)
RK_HIGH_UPR_3: 1_uC (D1.35), 3_RK (R72.2)
RK_HIGH_UPR_4: 1_uC (D1.34), 3_RK (R73.2)
RK_LOW_1: 2_Connection (X7.6), 3_RK (R66.1)
RK_LOW_2: 2_Connection (X7.7), 3_RK (R67.1)
RK_LOW_3: 2_Connection (X7.8), 3_RK (R68.1)
RK_LOW_4: 2_Connection (X7.9), 3_RK (R69.1)
RK_LOW_UPR_1: 1_uC (D1.41), 3_RK (R58.2)
RK_LOW_UPR_2: 1_uC (D1.40), 3_RK (R59.2)
RK_LOW_UPR_3: 1_uC (D1.39), 3_RK (R60.2)
RK_LOW_UPR_4: 1_uC (D1.38), 3_RK (R61.2)
Vcc_RK: 2_Connection (X7.5), 3_RK (9 pins)